# Altium project KeyBoardPower.PrjPcb
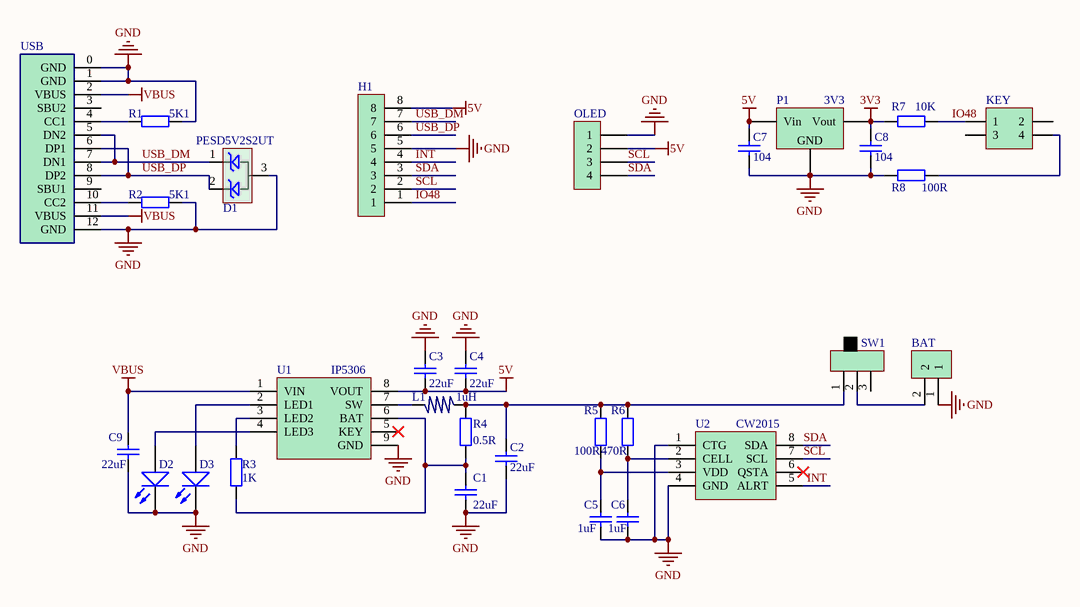
[diagram p0: KeyBoardPower.SchDoc]
1 sheet, 30 parts. Net scope: global (net labels, ports and power ports of the same name join across sheets).
Board file: KeyBoardPower.PcbDoc

## Sheet KeyBoardPower.SchDoc
size A4; SheetNumber: 1; SheetTotal: 1

### Parts
BAT  PH2.0mm  [PH2.0_2P_SMT_L]  (value not drawn)
C1  22uF  [0805]
C2  22uF  [0805]
C3  22uF  [0805]
C4  22uF  [0805]
C5  1uF  [0603]
C6  1uF  [0603]
C7  104  [0603]
C8  104  [0603]
C9  22uF  [0805]
D1  PESD5V2S2UT  [SOT23]
D2  LED  [LED_0603]  (value not drawn)
D3  LED  [LED_0603]  (value not drawn)
H1  SH1.25mm_8P  [SH1.25MM_8P]  (value not drawn)
KEY  KEY  [KEY_DIP_6]  (value not drawn)
L1  1uH  [L_0420]
OLED  Header_2.54_4P  [HDR1_4P]  (value not drawn)
P1  3V3  [SOT23]
R1  5K1  [R_0603]
R2  5K1  [R_0603]
R3  1K  [R_0603]
R4  0.5R  [R_0603]
R5  100R  [R_0603]
R6  470R  [R_0603]
R7  10K  [R_0603]
R8  100R  [R_0603]
SW1  SWITCH  [SWITCH_SS12D10]  (value not drawn)
U1  IP5306  [eSOP8]
U2  CW2015  [CW2015_TDFN]
USB  USB_C  [USB_C_16P_SMT]  (value not drawn)

### Nets
3V3: C8.2 P1.2(Vout) R7.1
5V: C3.1 C4.1 C7.2 H1.8 OLED.2 P1.3(Vin) U1.8(VOUT)
GND: BAT.1 C1.1 C2.1 C3.2 C4.2 C5.1 C6.1 C7.1 C8.1 C9.1 D1.3 D2.K D3.K H1.5 OLED.1 P1.1(GND) R1.2 R2.2 R8.1 U1.9(GND) U2.1(CTG) U2.4(GND) USB.0(GND) USB.1(GND) USB.12(GND)
VBUS: C9.2 U1.1(VIN) USB.2(VBUS) USB.11(VBUS)
INT: H1.4 U2.5(ALRT)
IO48: H1.1 KEY.1 R7.2
SCL: H1.2 OLED.3 U2.7(SCL)
SDA: H1.3 OLED.4 U2.8(SDA)
USB_DM: D1.1 H1.7 USB.5(DN2) USB.7(DN1)
USB_DP: D1.2 H1.6 USB.6(DP1) USB.8(DP2)
NetBAT_2: BAT.2 SW1.2
NetC1_2: C1.2 R3.1 R4.1 U1.6(BAT)
NetC2_2: C2.2 L1.1 R4.2 R5.2 R6.1 SW1.1
NetC5_2: C5.2 R5.1 U2.3(VDD)
NetC6_2: C6.2 R6.2 U2.2(CELL)
NetD2_A: D2.A U1.4(LED3)
NetD3_A: D3.A U1.2(LED1)
NetKEY_4: KEY.4 R8.2
NetL1_2: L1.2 U1.7(SW)
NetR1_1: R1.1 USB.4(CC1)
NetR2_1: R2.1 USB.10(CC2)
NetR3_2: R3.2 U1.3(LED2)

Not connected (* = marked no-connect by the designer): KEY 2 3; SW1 3; U1 5(KEY)*; U2 6(QSTA)*; USB 3(SBU2) 9(SBU1)

### Library data of the parts
BAT = PH2.0mm_2P_SMT_L: PH2.0
C1-C4 C9 = CAP_0805: 贴片电容 0805
C5-C8 = CAP_0603: 贴片电容 0603
D1 = PESD5V2S2UT: ESD DIODE
D2 D3 = LED_0603: LED 0603
H1 = SH1.25mm_8P: SH
KEY = KEY_DIP_6: 直插立式按键 6mm
L1 = L_0420: 电感 0420
OLED = Header_2.54_4P: PinHeader 2.54
P1 = LDO_XC6206P332MR: 线性稳压器
R1-R8 = RES_0603: 电阻 0603
SW1 = SWITCH_SS12D10: 直插3A滑动开关
U1 = IP5306: 电池充电
U2 = CW2015_TDFN: 锂电池电量计
USB = USB_C_16P_SMT: 全贴片USB C母座